# Altium schematic sheet Sheet2-power.SchDoc
size A4; SheetNumber: 3; SheetTotal: 4
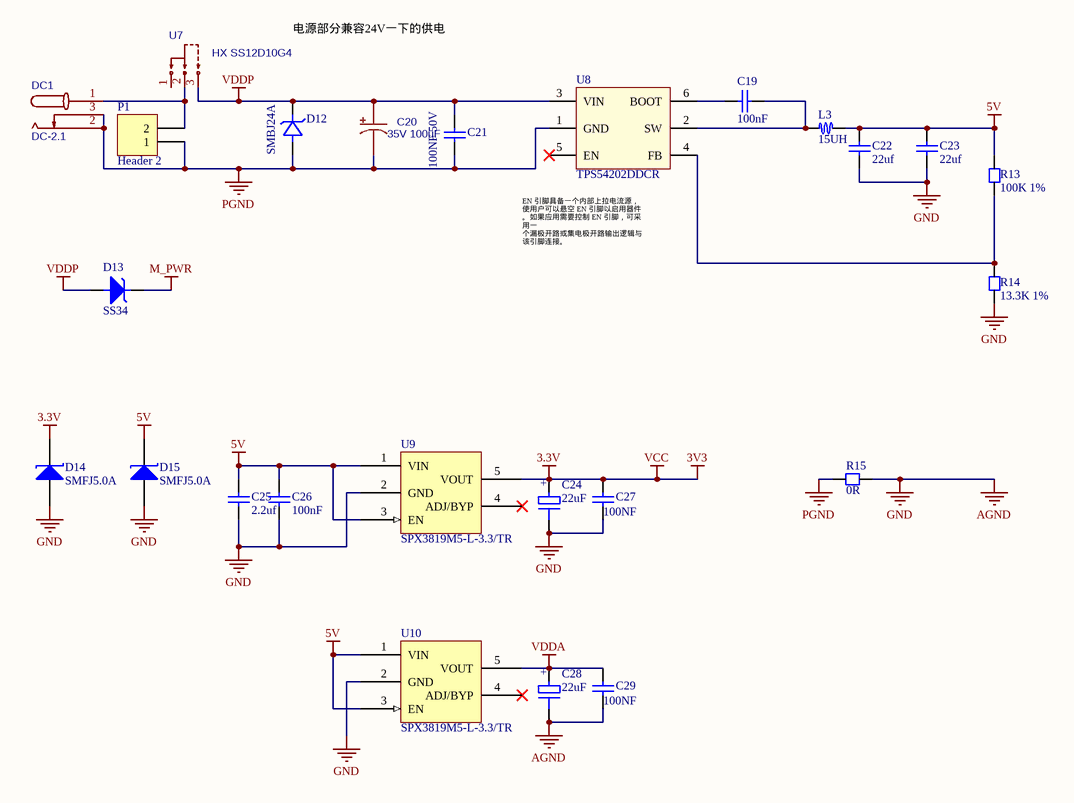
[diagram p0: Sheet2-power.SchDoc]

## Parts
C19  100nF  [CC1608-0603]
C20  35V 100uF  [CAP-SMD_D6.3]
C21  100NF 50V  [CC1608-0603]
C22  22uf  [CC1608-0603]
C23  22uf  [CC1608-0603]
C24  22uF  [TAN-A-1206]
C25  2.2uf  [CC1608-0603]
C26  100nF  [CC1608-0603]
C27  100NF  [CC1608-0603]
C28  22uF  [TAN-A-1206]
C29  100NF  [CC1608-0603]
D12  SMBJ24A  [DO-214 AA]
D13  SS34  [DO-214 AA]
D14  SMFJ5.0A  [SOD-123]
D15  SMFJ5.0A  [SOD-123]
DC1  DC-2.1  [DC-IN-SMD_DC-050-25A]
L3  15UH  [Inductor-0630]
P1  Header 2  [HX2.54-2]
R13  100K 1%  [CR1608-0603]
R14  13.3K 1%  [CR1608-0603]
R15  0R  [CR1608-0603]
U7  HX SS12D10G4  [SS12D10-G4]
U8  TPS54202DDCR  [SOT23-6]
U9  SPX3819M5-L-3.3/TR  [SOT23-5]
U10  SPX3819M5-L-3.3/TR  [SOT23-5]

## Nets
3.3V: C24.1(+) C27.1 D14.1 U9.5(VOUT)  [also labelled 3V3, VCC]
5V: C22.2 C23.2 C25.2 C26.2 D15.1 L3.2 R13.2 U9.1(VIN) U9.3(EN) U10.1(VIN) U10.3(EN)
AGND: C22.1 C23.1 C24.2(-) C25.1 C26.1 C27.2 C28.2(-) C29.2 D14.2 D15.2 R14.1 R15.1 U9.2(GND) U10.2(GND)  [also labelled GND]
M_PWR: D13.1(K)
PGND: C20.2 C21.1 D12.2(A) DC1.2 DC1.3 P1.1 R15.2 U8.1(GND)
VDDA: C28.1(+) C29.1 U10.5(VOUT)
VDDP: C20.1 C21.2 D12.1(K) D13.2(A) U7.3 U8.3(VIN)
NetC19_1: C19.1 U8.6(BOOT)
NetC19_2: C19.2 L3.1 U8.2(SW)
NetDC1_1: DC1.1 P1.2 U7.2
NetR13_1: R13.1 R14.2 U8.4(FB)

Not connected (* = marked no-connect by the designer): U7 1; U8 5(EN)*; U9 4(ADJ/BYP)*; U10 4(ADJ/BYP)*

## Notes on the sheet
- 电源部分兼容24V一下的供电
- (near U8) EN 引脚具备一个内部上拉电流源，使用户可以悬空 EN 引脚以启用器件。如果应用需要控制 EN 引脚，可采用一
  个漏极开路或集电极开路输出逻辑与该引脚连接。

## Library data of the parts
C19 C21-C23 C25 C26 = Cap Chip 0603: 0603封装的电容; Published: 8-Jun-2000; Revision: July-2002: Re-released for DXP Platform.; Publisher: Altium Limited
C20 = Cap ECAP SMD: 铝点解电容; BOM_Manufacturer: PANASONIC; BOM_Manufacturer Part: EEEFP1C681AP; nameAlias: Capacitance; Contributor: LCSC; BOM_Supplier: LCSC; BOM_Supplier Part: C413527; spicePre: C; spiceSymbolName: EEEFP1C681AP
C24 C28 = CAP TAN-A-1206: 钽电容
C27 C29 = Chip capacitor: 贴片电容
D12 = SMBJ18A: TVS稳压二极管
D13 = SS34: 肖特基二极管
D14 D15 = SMFJ5.0A: 5V单向贴片TVS瞬变抑制二极管
DC1 = DC-050: DC贴片插座; BOM_Manufacturer: 韩国韩荣; BOM_Manufacturer Part: DC-050-25A; Contributor: LCSC; BOM_Supplier: LCSC; BOM_Supplier Part: C707275; BOM_JLCPCB Part Class: Extended Part; spicePre: D; spiceSymbolName: DC-050-25A
L3 = Inductor-0630: 贴片电感 0630封装
P1 = Header 2: Header, 2-Pin; LatestRevisionDate: 17-Jul-2002; LatestRevisionNote: Re-released for DXP Platform.; Publisher: Altium Limited
R13-R15 = Resistor Chip 0603: 0603封装电阻; Published: 8-Jun-2000; Revision: July-2002: Re-released for DXP Platform.; Publisher: Altium Limited
U7 = SS12D10G4: BOM_Manufacturer: hanxia(韩下); Contributor: lcsc; BOM_Supplier: LCSC; BOM_Supplier Part: C5149841; BOM_Manufacturer Part: HX SS12D10G4; link: https://atta.szlcsc.com/upload/public/pdf/source/20220907/2020D7183ED16DD6E2B9F5A13FB144CF.pdf; BOM_JLCPCB Part Class: Extended Part; spicePre: U; spiceSymbolName: HX SS12D10G4
U8 = TPS54202DDCR: 同步降压转换器芯片 500Khz 4.2~28V输入，2A输出
U9 U10 = SPX3819M5-L-3.3/TR: LDO 3.3V , SOT-23-5 500ma